# Altium schematic sheet Switcher-planB.SchDoc
size A3
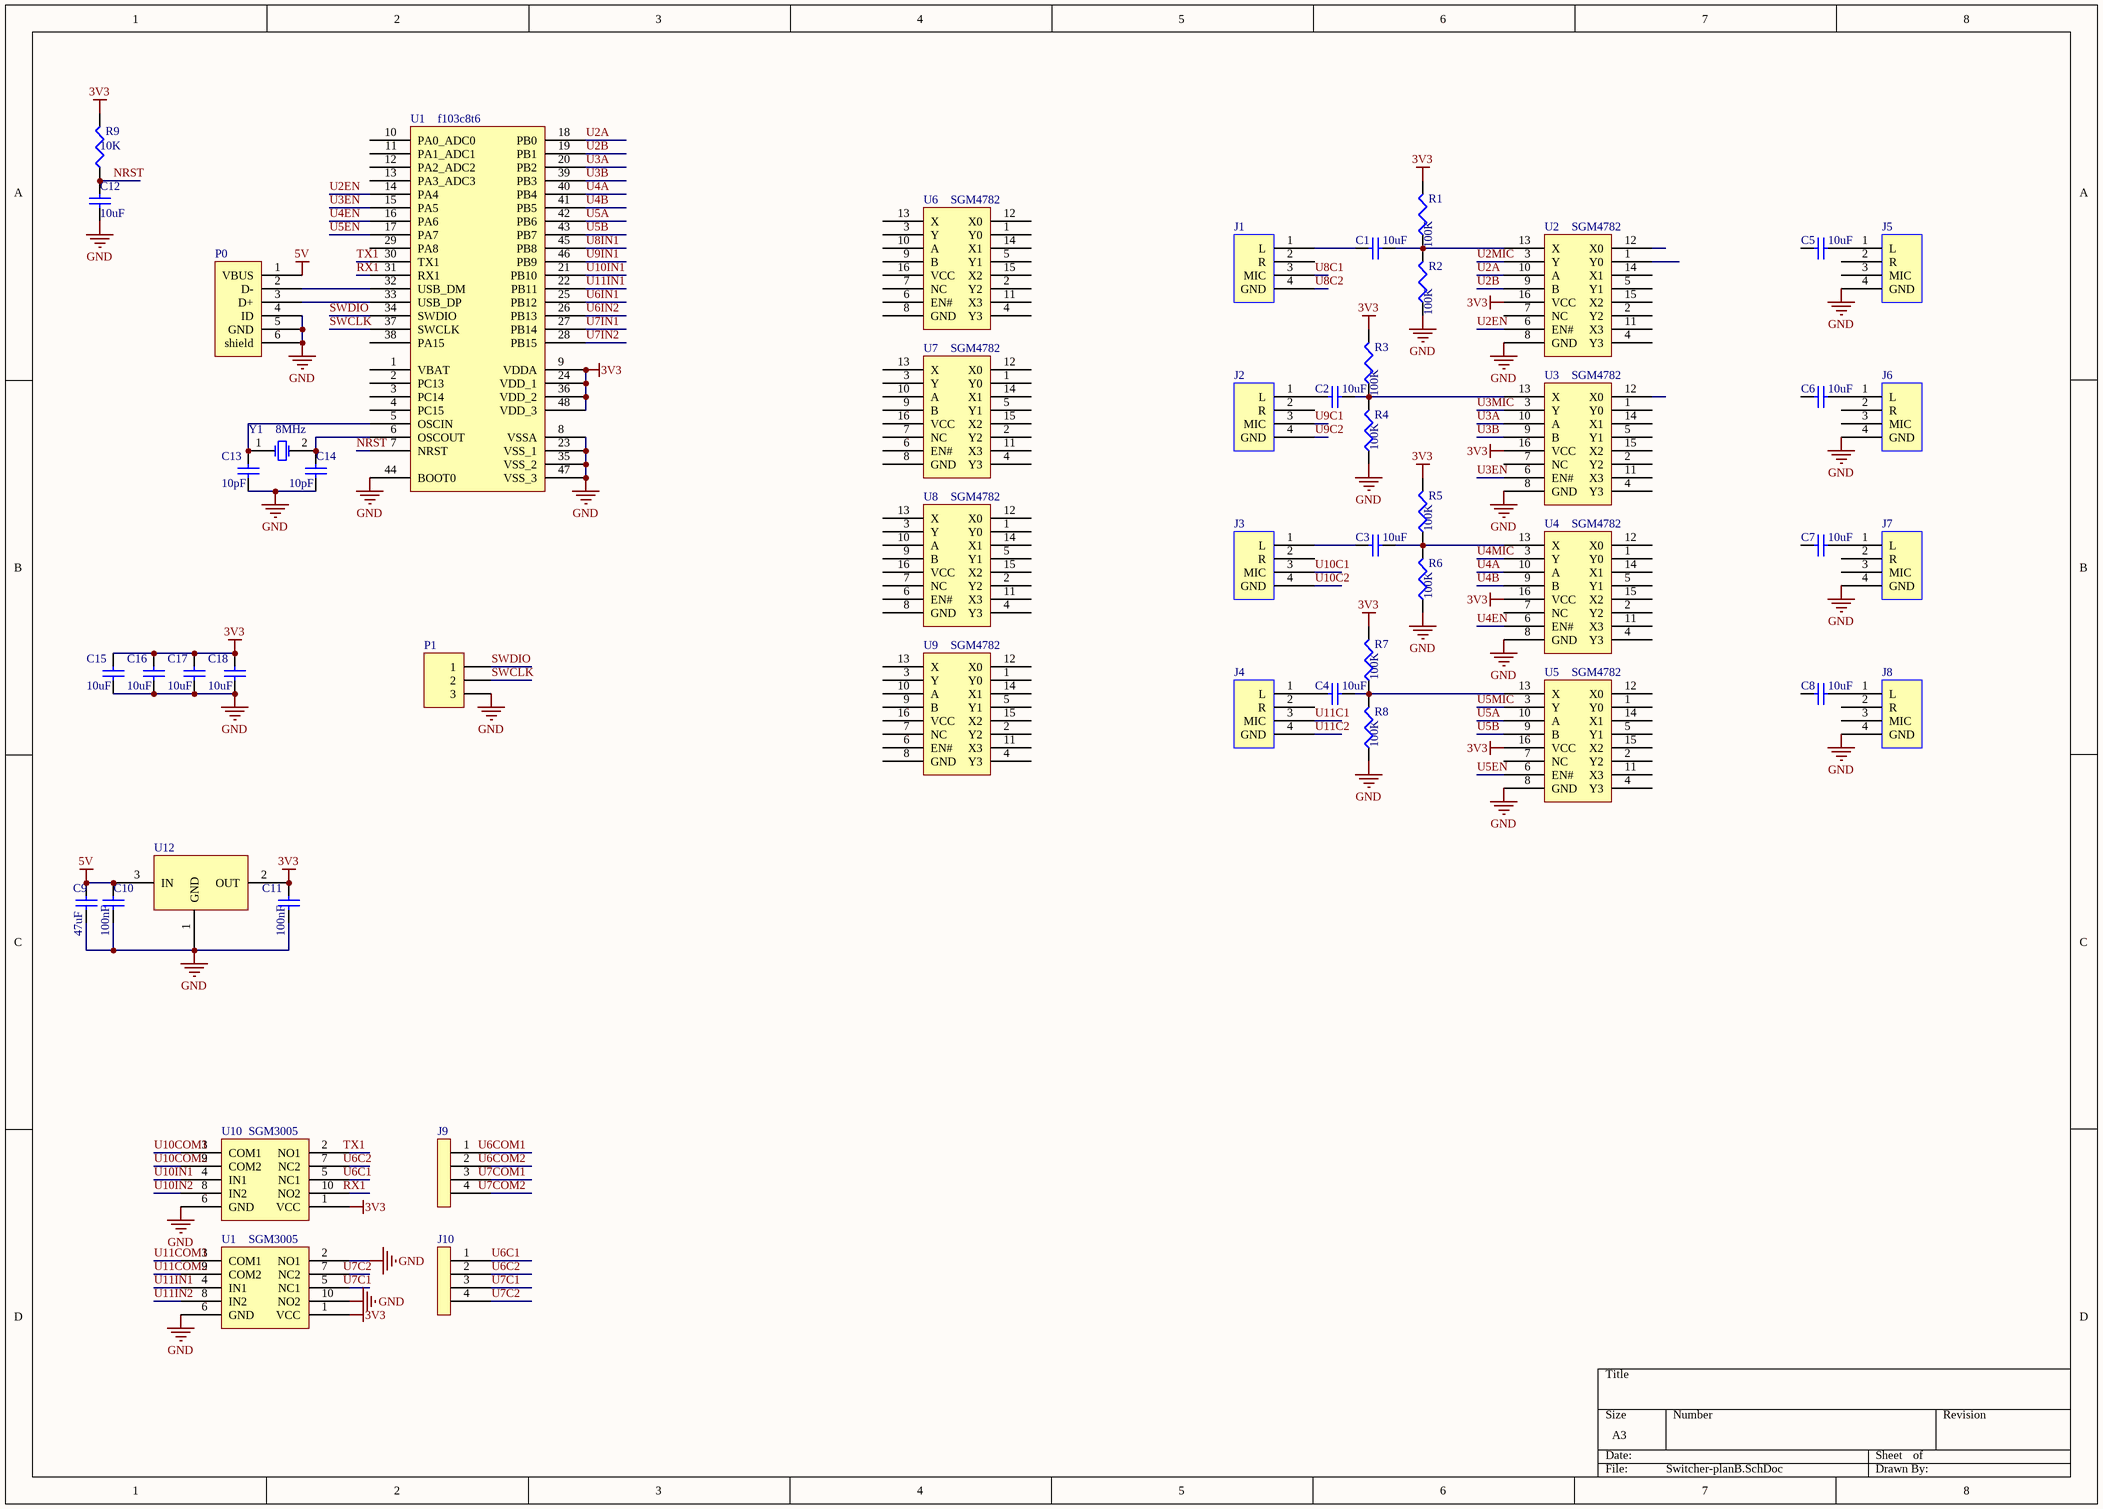
[diagram p0: Switcher-planB.SchDoc]

## Parts
(Parts that share a designator on the sheet are numbered #1, #2 ... from top to bottom, then left to right.)
C1  value 10uF  [SMT0603]
C2  value 10uF  [SMT0603]
C3  value 10uF  [SMT0603]
C4  value 10uF  [SMT0603]
C5  value 10uF  [SMT0603]
C6  value 10uF  [SMT0603]
C7  value 10uF  [SMT0603]
C8  value 10uF  [SMT0603]
C9  value 47uF  [SMT0603]
C10  value 100nF  [SMT0603]
C11  value 100nF  [SMT0603]
C12  value 10uF  [SMT0603]
C13  value 10pF  [SMT0603]
C14  value 10pF  [SMT0603]
C15  value 10uF  [SMT0603]
C16  value 10uF  [SMT0603]
C17  value 10uF  [SMT0603]
C18  value 10uF  [SMT0603]
J1  (no value)  [PJ-322]
J2  (no value)  [PJ-322]
J3  (no value)  [PJ-322]
J4  (no value)  [PJ-322]
J5  (no value)  [PJ-322]
J6  (no value)  [PJ-322]
J7  (no value)  [PJ-322]
J8  (no value)  [PJ-322]
J9  (no value)  [PJ-322]
J10  (no value)  [PJ-322]
P0  (no value)  [USB_MICRO]
P1  (no value)  [SIP3]
R1  value 100K  [SMT0603]
R2  value 100K  [SMT0603]
R3  value 100K  [SMT0603]
R4  value 100K  [SMT0603]
R5  value 100K  [SMT0603]
R6  value 100K  [SMT0603]
R7  value 100K  [SMT0603]
R8  value 100K  [SMT0603]
R9  value 10K  [SMT0603]
U1#1  f103c8t6  [LQFP48]
U1#2  SGM3005  [MSOP-10]
U2  SGM4782  [TSSOP-16]
U3  SGM4782  [TSSOP-16]
U4  SGM4782  [TSSOP-16]
U5  SGM4782  [TSSOP-16]
U6  SGM4782  [TSSOP-16]
U7  SGM4782  [TSSOP-16]
U8  SGM4782  [TSSOP-16]
U9  SGM4782  [TSSOP-16]
U10  SGM3005  [MSOP-10]
U12  (no value)  [SOT-223]
Y1  8MHz  [XTAL1]

## Nets
3V3: C11.2 C15.2 C16.2 C17.2 C18.2 R1.2 R3.2 R5.2 R7.2 R9.2 U1#1.9(VDDA) U1#1.24(VDD_1) U1#1.36(VDD_2) U1#1.48(VDD_3) U1#2.1(VCC) U2.16(VCC) U3.16(VCC) U4.16(VCC) U5.16(VCC) U10.1(VCC) U12.2(OUT)
5V: C9.2 C10.2 P0.1(VBUS) U12.3(IN)
GND: C9.1 C10.1 C11.1 C12.1 C13.1 C14.1 C15.1 C16.1 C17.1 C18.1 J5.4(GND) J6.4(GND) J7.4(GND) J8.4(GND) P0.4(ID) P0.5(GND) P0.6(shield) P1.3 R2.1 R4.1 R6.1 R8.1 U1#1.8(VSSA) U1#1.23(VSS_1) U1#1.35(VSS_2) U1#1.44(BOOT0) U1#1.47(VSS_3) U1#2.2(NO1) U1#2.6(GND) U1#2.10(NO2) U2.8(GND) U3.8(GND) U4.8(GND) U5.8(GND) U10.6(GND) U12.1(GND)
NRST: C12.2 R9.1 U1#1.7(NRST)
RX1: U1#1.31(RX1)
SWCLK: P1.2 U1#1.37(SWCLK)
SWDIO: P1.1 U1#1.34(SWDIO)
TX1: U1#1.30(TX1)
U2A: U1#1.18(PB0) U2.10(A)
U2B: U1#1.19(PB1) U2.9(B)
U2EN: U1#1.14(PA4) U2.6(EN#)
U2MIC: U2.3(Y)
U3A: U1#1.20(PB2) U3.10(A)
U3B: U1#1.39(PB3) U3.9(B)
U3EN: U1#1.15(PA5) U3.6(EN#)
U3MIC: U3.3(Y)
U4A: U1#1.40(PB4) U4.10(A)
U4B: U1#1.41(PB5) U4.9(B)
U4EN: U1#1.16(PA6) U4.6(EN#)
U4MIC: U4.3(Y)
U5A: U1#1.42(PB6) U5.10(A)
U5B: U1#1.43(PB7) U5.9(B)
U5EN: U1#1.17(PA7) U5.6(EN#)
U5MIC: U5.3(Y)
U6C1: J10.1
U6C2: J10.2
U6IN1: U1#1.25(PB12)
U6IN2: U1#1.26(PB13)
U7C1: J10.3
U7C2: J10.4
U7IN1: U1#1.27(PB14)
U7IN2: U1#1.28(PB15)
U8C1: J1.3(MIC)
U8C2: J1.4(GND)
U8IN1: U1#1.45(PB8)
U9C1: J2.3(MIC)
U9C2: J2.4(GND)
U9IN1: U1#1.46(PB9)
U10C1: J3.3(MIC)
U10C2: J3.4(GND)
U10COM1: U10.3(COM1)
U10COM2: U10.9(COM2)
U10IN1: U1#1.21(PB10) U10.4(IN1)
U10IN2: U10.8(IN2)
U11C1: J4.3(MIC)
U11C2: J4.4(GND)
U11COM1: U1#2.3(COM1)
U11COM2: U1#2.9(COM2)
U11IN1: U1#1.22(PB11) U1#2.4(IN1)
U11IN2: U1#2.8(IN2)
NetC1_1: C1.1 J1.1(L)
NetC1_2: C1.2 R1.1 R2.2 U2.13(X)
NetC2_1: C2.1 J2.1(L)
NetC2_2: C2.2 R3.1 R4.2 U3.13(X)
NetC3_1: C3.1 J3.1(L)
NetC3_2: C3.2 R5.1 R6.2 U4.13(X)
NetC4_1: C4.1 J4.1(L)
NetC4_2: C4.2 R7.1 R8.2 U5.13(X)
NetC5_2: C5.2 J5.1(L)
NetC6_2: C6.2 J6.1(L)
NetC7_2: C7.2 J7.1(L)
NetC8_2: C8.2 J8.1(L)
NetC13_2: C13.2 U1#1.5(OSCIN) Y1.1(OSC1)
NetC14_2: C14.2 U1#1.6(OSCOUT) Y1.2(OSC2)
NetP0_2: P0.2(D-) U1#1.32(USB_DM)
NetP0_3: P0.3(D+) U1#1.33(USB_DP)

Not connected (* = marked no-connect by the designer): C5 1; C6 1; C7 1; C8 1; J1 2(R); J2 2(R); J3 2(R); J4 2(R); J5 2(R) 3(MIC); J6 2(R) 3(MIC); J7 2(R) 3(MIC); J8 2(R) 3(MIC); J9 1 2 3 4; U1#1 1(VBAT) 2(PC13) 3(PC14) 4(PC15) 10(PA0_ADC0) 11(PA1_ADC1) 12(PA2_ADC2) 13(PA3_ADC3) 29(PA8) 38(PA15); U1#2 5(NC1) 7(NC2); U2 1(Y0) 2(Y2) 4(Y3) 5(Y1) 7(NC) 11(X3) 12(X0) 14(X1) 15(X2); U3 1(Y0) 2(Y2) 4(Y3) 5(Y1) 7(NC) 11(X3) 12(X0) 14(X1) 15(X2); U4 1(Y0) 2(Y2) 4(Y3) 5(Y1) 7(NC) 11(X3) 12(X0) 14(X1) 15(X2); U5 1(Y0) 2(Y2) 4(Y3) 5(Y1) 7(NC) 11(X3) 12(X0) 14(X1) 15(X2); U6 1(Y0) 2(Y2) 3(Y) 4(Y3) 5(Y1) 6(EN#) 7(NC) 8(GND) 9(B) 10(A) 11(X3) 12(X0) 13(X) 14(X1) 15(X2) 16(VCC); U7 1(Y0) 2(Y2) 3(Y) 4(Y3) 5(Y1) 6(EN#) 7(NC) 8(GND) 9(B) 10(A) 11(X3) 12(X0) 13(X) 14(X1) 15(X2) 16(VCC); U8 1(Y0) 2(Y2) 3(Y) 4(Y3) 5(Y1) 6(EN#) 7(NC) 8(GND) 9(B) 10(A) 11(X3) 12(X0) 13(X) 14(X1) 15(X2) 16(VCC); U9 1(Y0) 2(Y2) 3(Y) 4(Y3) 5(Y1) 6(EN#) 7(NC) 8(GND) 9(B) 10(A) 11(X3) 12(X0) 13(X) 14(X1) 15(X2) 16(VCC); U10 2(NO1) 5(NC1) 7(NC2) 10(NO2)

## Notes on the sheet
- Labels drawn without touching a wire or pin: RX1, TX1, U6C1, U6C2, U6COM1, U6COM2, U7C1, U7C2, U7COM1, U7COM2

## Library data of the parts
C1-C18 = Cap: Capacitor; Published: 8-Jun-2000; LatestRevisionDate: 17-Jul-2002; LatestRevisionNote: Re-released for DXP Platform.; PackageReference: RAD-0.3; Publisher: Altium Limited; PackageDescription: Radial Cap, Thru-Hole; 2 Leads; 0.3 in Pin Spacing
J1-J4 J6-J8 = seg-4
J5 = seg-4: OMTP
J9 J10 = CON4
P0 = micro_usb
P1 = Header 3: Header, 3-Pin; LatestRevisionDate: 17-Jul-2002; LatestRevisionNote: Re-released for DXP Platform.; Publisher: Altium Limited
R1-R9 = Res3: Resistor; Published: 8-Jun-2000; LatestRevisionDate: 29-May-2009; LatestRevisionNote: IPC-7351 Footprint Added.; PackageReference: J1-0603; Publisher: Altium Limited; PackageDescription: Chip Resistor
U12 = ASM1117-3.3
Y1 = XTAL: Crystal Oscillator; Published: 8-Jun-2000; LatestRevisionDate: 17-Jul-2002; LatestRevisionNote: Re-released for DXP Platform.; PackageReference: R38; Publisher: Altium Limited; PackageDescription: Crystal, Thru-Hole; 2 Leads; Body 3.1 x 8.2 mm (Dia.xH)